# Altium project 电感.PrjPcb
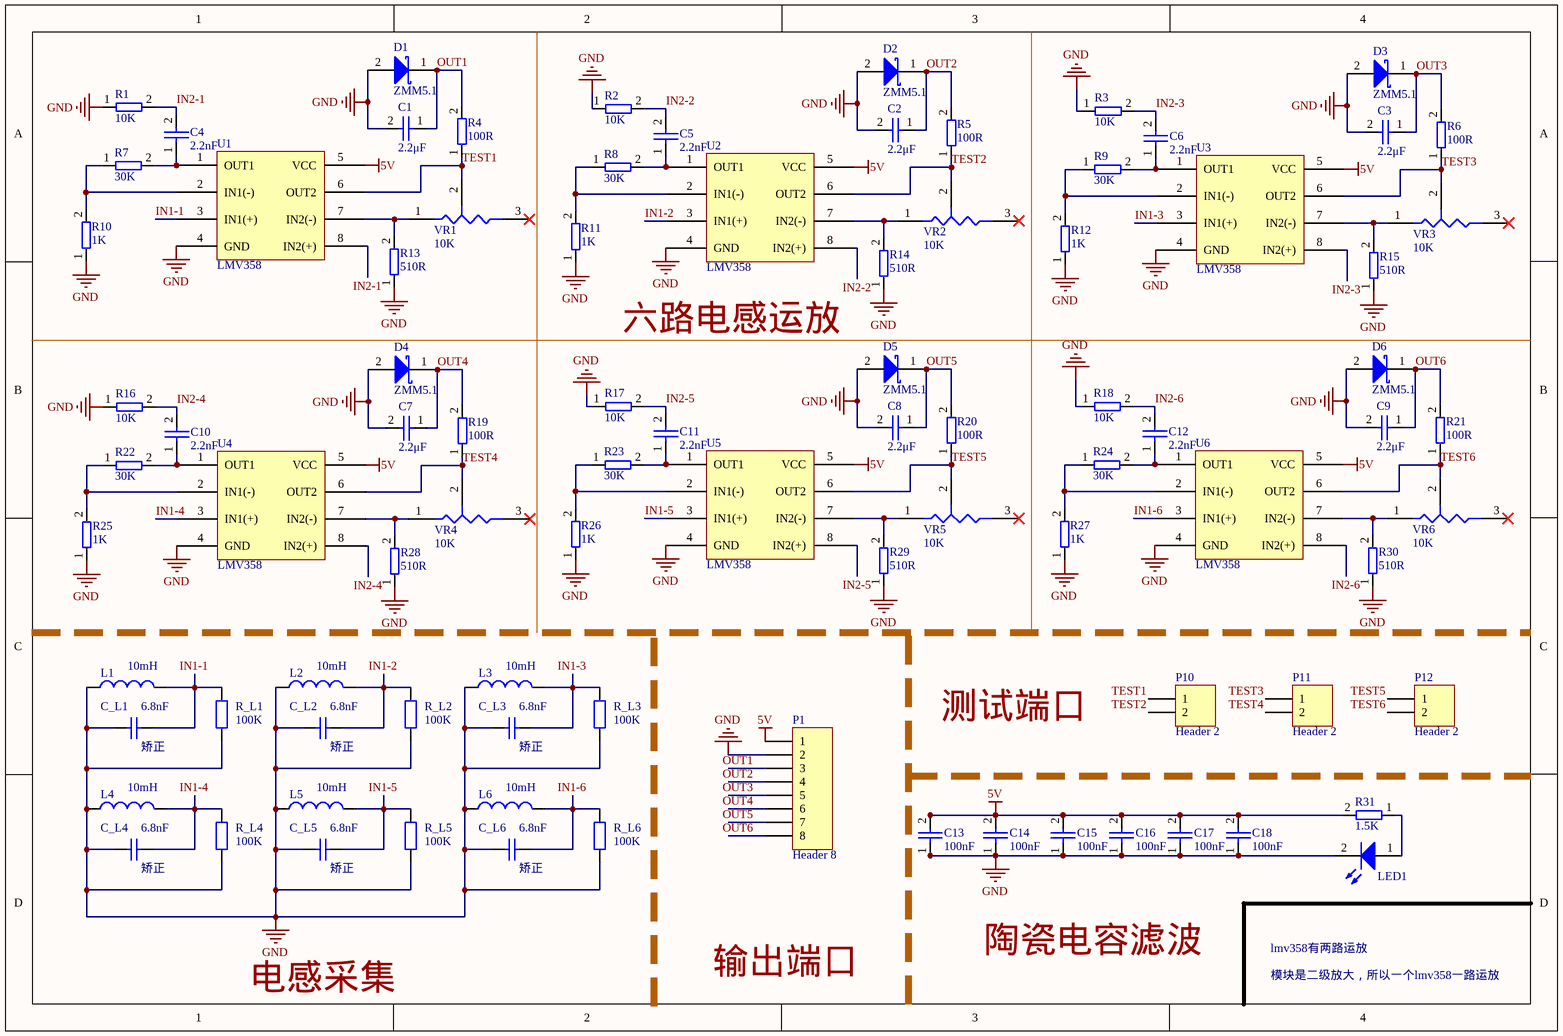
[diagram p0: 电感板原理图.SchDoc]
1 sheet, 90 parts. Net scope: global (net labels, ports and power ports of the same name join across sheets).
Board file: 电感板PCB.PcbDoc

## Sheet 电感板原理图.SchDoc
size A4

### Parts
C1  2.2μF  [C 0603_L]
C2  2.2μF  [C 0603_L]
C3  2.2μF  [C 0603_L]
C4  2.2nF  [0805C]
C5  2.2nF  [0805C]
C6  2.2nF  [0805C]
C7  2.2μF  [C 0603_L]
C8  2.2μF  [C 0603_L]
C9  2.2μF  [C 0603_L]
C10  2.2nF  [0805C]
C11  2.2nF  [0805C]
C12  2.2nF  [0805C]
C13  100nF  [0805C]
C14  100nF  [0805C]
C15  100nF  [0805C]
C16  100nF  [0805C]
C17  100nF  [0805C]
C18  100nF  [0805C]
C_L1  矫正  value 6.8nF  [RAD-0.3]
C_L2  矫正  value 6.8nF  [RAD-0.3]
C_L3  矫正  value 6.8nF  [RAD-0.3]
C_L4  矫正  value 6.8nF  [RAD-0.3]
C_L5  矫正  value 6.8nF  [RAD-0.3]
C_L6  矫正  value 6.8nF  [RAD-0.3]
D1  ZMM5.1  [1206C]
D2  ZMM5.1  [1206C]
D3  ZMM5.1  [1206C]
D4  ZMM5.1  [1206C]
D5  ZMM5.1  [1206C]
D6  ZMM5.1  [1206C]
L1  value 10mH  [HDR1X2]  (hidden comment: Inductor)
L2  value 10mH  [HDR1X2]  (hidden comment: Inductor)
L3  value 10mH  [HDR1X2]  (hidden comment: Inductor)
L4  value 10mH  [HDR1X2]  (hidden comment: Inductor)
L5  value 10mH  [HDR1X2]  (hidden comment: Inductor)
L6  value 10mH  [HDR1X2]  (hidden comment: Inductor)
LED1  LED  [LED0805R]  (value not drawn)
P1  Header 8  [HDR1X8]
P10  Header 2  [HDR1X2]
P11  Header 2  [HDR1X2]
P12  Header 2  [HDR1X2]
R1  10K  [0805-1R]
R2  10K  [0805-1R]
R3  10K  [0805-1R]
R4  100R  [0805-0R]
R5  100R  [0805-0R]
R6  100R  [0805-0R]
R7  30K  [0805-1R]
R8  30K  [0805-1R]
R9  30K  [0805-1R]
R10  1K  [0805-1R]
R11  1K  [0805-1R]
R12  1K  [0805-1R]
R13  510R  [0805-0R]
R14  510R  [0805-0R]
R15  510R  [0805-0R]
R16  10K  [0805-1R]
R17  10K  [0805-1R]
R18  10K  [0805-1R]
R19  100R  [0805-0R]
R20  100R  [0805-0R]
R21  100R  [0805-0R]
R22  30K  [0805-1R]
R23  30K  [0805-1R]
R24  30K  [0805-1R]
R25  1K  [0805-1R]
R26  1K  [0805-1R]
R27  1K  [0805-1R]
R28  510R  [0805-0R]
R29  510R  [0805-0R]
R30  510R  [0805-0R]
R31  1.5K  [0805-1R]
R_L1  value 100K  [0805-1R]  (hidden comment: Res2)
R_L2  value 100K  [0805-1R]  (hidden comment: Res2)
R_L3  value 100K  [0805-1R]  (hidden comment: Res2)
R_L4  value 100K  [0805-1R]  (hidden comment: Res2)
R_L5  value 100K  [0805-1R]  (hidden comment: Res2)
R_L6  value 100K  [0805-1R]  (hidden comment: Res2)
U1  LMV358  [SOP8]
U2  LMV358  [SOP8]
U3  LMV358  [SOP8]
U4  LMV358  [SOP8]
U5  LMV358  [SOP8]
U6  LMV358  [SOP8]
VR1  10K  [3296W]
VR2  10K  [3296W]
VR3  10K  [3296W]
VR4  10K  [3296W]
VR5  10K  [3296W]
VR6  10K  [3296W]

### Nets
5V: C13.2 C14.2 C15.2 C16.2 C17.2 C18.2 P1.1 R31.2 U1.5(VCC) U2.5(VCC) U3.5(VCC) U4.5(VCC) U5.5(VCC) U6.5(VCC)
GND: C1.2 C2.2 C3.2 C7.2 C8.2 C9.2 C13.1 C14.1 C15.1 C16.1 C17.1 C18.1 C_L1.1 C_L2.1 C_L3.1 C_L4.1 C_L5.1 C_L6.1 D1.2(A) D2.2(A) D3.2(A) D4.2(A) D5.2(A) D6.2(A) L1.1 L2.1 L3.1 L4.1 L5.1 L6.1 LED1.2(K) P1.2 R1.1 R2.1 R3.1 R10.1 R11.1 R12.1 R13.1 R14.1 R15.1 R16.1 R17.1 R18.1 R25.1 R26.1 R27.1 R28.1 R29.1 R30.1 R_L1.1 R_L2.1 R_L3.1 R_L4.1 R_L5.1 R_L6.1 U1.4(GND) U2.4(GND) U3.4(GND) U4.4(GND) U5.4(GND) U6.4(GND)
IN1-1: C_L1.2 L1.2 R_L1.2 U1.3(IN1(+))
IN1-2: C_L2.2 L2.2 R_L2.2 U2.3(IN1(+))
IN1-3: C_L3.2 L3.2 R_L3.2 U3.3(IN1(+))
IN1-4: C_L4.2 L4.2 R_L4.2 U4.3(IN1(+))
IN1-5: C_L5.2 L5.2 R_L5.2 U5.3(IN1(+))
IN1-6: C_L6.2 L6.2 R_L6.2 U6.3(IN1(+))
IN2-1: C4.2 R1.2 U1.8(IN2(+))
IN2-2: C5.2 R2.2 U2.8(IN2(+))
IN2-3: C6.2 R3.2 U3.8(IN2(+))
IN2-4: C10.2 R16.2 U4.8(IN2(+))
IN2-5: C11.2 R17.2 U5.8(IN2(+))
IN2-6: C12.2 R18.2 U6.8(IN2(+))
OUT1: C1.1 D1.1(K) P1.3 R4.2
OUT2: C2.1 D2.1(K) P1.4 R5.2
OUT3: C3.1 D3.1(K) P1.5 R6.2
OUT4: C7.1 D4.1(K) P1.6 R19.2
OUT5: C8.1 D5.1(K) P1.7 R20.2
OUT6: C9.1 D6.1(K) P1.8 R21.2
TEST1: P10.1 R4.1 U1.6(OUT2) VR1.2(TAP)
TEST2: P10.2 R5.1 U2.6(OUT2) VR2.2(TAP)
TEST3: P11.1 R6.1 U3.6(OUT2) VR3.2(TAP)
TEST4: P11.2 R19.1 U4.6(OUT2) VR4.2(TAP)
TEST5: P12.1 R20.1 U5.6(OUT2) VR5.2(TAP)
TEST6: P12.2 R21.1 U6.6(OUT2) VR6.2(TAP)
NetC4_1: C4.1 R7.2 U1.1(OUT1)
NetC5_1: C5.1 R8.2 U2.1(OUT1)
NetC6_1: C6.1 R9.2 U3.1(OUT1)
NetC10_1: C10.1 R22.2 U4.1(OUT1)
NetC11_1: C11.1 R23.2 U5.1(OUT1)
NetC12_1: C12.1 R24.2 U6.1(OUT1)
NetLED1_1: LED1.1(A) R31.1
NetR7_1: R7.1 R10.2 U1.2(IN1(-))
NetR8_1: R8.1 R11.2 U2.2(IN1(-))
NetR9_1: R9.1 R12.2 U3.2(IN1(-))
NetR13_2: R13.2 U1.7(IN2(-)) VR1.1(A)
NetR14_2: R14.2 U2.7(IN2(-)) VR2.1(A)
NetR15_2: R15.2 U3.7(IN2(-)) VR3.1(A)
NetR22_1: R22.1 R25.2 U4.2(IN1(-))
NetR23_1: R23.1 R26.2 U5.2(IN1(-))
NetR24_1: R24.1 R27.2 U6.2(IN1(-))
NetR28_2: R28.2 U4.7(IN2(-)) VR4.1(A)
NetR29_2: R29.2 U5.7(IN2(-)) VR5.1(A)
NetR30_2: R30.2 U6.7(IN2(-)) VR6.1(A)

Not connected (* = marked no-connect by the designer): VR1 3(B)*; VR2 3(B)*; VR3 3(B)*; VR4 3(B)*; VR5 3(B)*; VR6 3(B)*

### Notes on the sheet
- 六路电感运放
- 测试端口
- 输出端口
- 陶瓷电容滤波
- 模块是二级放大，所以一个lmv358一路运放
- lmv358有两路运放
- 电感采集

### Library data of the parts
C1-C12 = Cap
C13-C18 = Cap: 陶瓷电容
C_L1-C_L6 = Cap: Capacitor; Published: 8-Jun-2000; LatestRevisionDate: 17-Jul-2002; LatestRevisionNote: Re-released for DXP Platform.; PackageReference: RAD-0.3; Publisher: Altium Limited; PackageDescription: Radial Cap, Thru-Hole; 2 Leads; 0.3 in Pin Spacing
D1-D6 = Diode 10TQ040: Schottky Rectifier; pin to pad: 3>2; Note: Terminal 2 is the TAB and is electrically connected to the cathode; Published: 8-Jun-2000; LatestRevisionDate: 17-Jul-2002; LatestRevisionNote: Re-released for DXP Platform.; DatasheetVersion: PD-2.057B; PackageVersion: Feb-1998; PackageReference: TO-220AC; Publisher: Altium Limited; PackageDescription: TO, Thru-Hole, Vertical, Heatsink Mounted; 3 In-Line Leads (1 Absent); Pitch 2.54 mm; ComponentLink1Description: Manufacturer Link; ComponentLink1URL: http://www.irf.com/
L1-L6 = Inductor: Code_IEC: 1005; Published: 8-Jun-2000; LatestRevisionDate: 29-May-2009; LatestRevisionNote: IPC-7351 Footprint Added.; PackageReference: 0402-A; Publisher: Altium Limited; PackageDescription: Chip Inductor; Code_JEITA: 0402
LED1 = LED3: Typical BLUE SiC LED; Published: 8-Jun-2000; LatestRevisionDate: 17-Dec-2003; LatestRevisionNote: PCB Footprint replaced.; DatasheetDocument: 16-Apr-2002; PackageDocument: 16-Apr-2002; PackageReference: 3.5X2.8X1.9; Publisher: Altium Limited
P1 = Header 8: Header, 8-Pin; LatestRevisionDate: 17-Jul-2002; LatestRevisionNote: Re-released for DXP Platform.; Publisher: Altium Limited
P10-P12 = Header 2: Header, 2-Pin; LatestRevisionDate: 17-Jul-2002; LatestRevisionNote: Re-released for DXP Platform.; Publisher: Altium Limited
R1-R31 = 0805R
R_L1-R_L6 = Res2: Resistor; Published: 8-Jun-2000; LatestRevisionDate: 17-Jul-2002; LatestRevisionNote: Re-released for DXP Platform.; PackageReference: AXIAL-0.4; Publisher: Altium Limited; PackageDescription: Axial Device, Thru-Hole; 2 Leads; 0.4 in Pin Spacing
U1-U6 = LMV358: pin to pad: 5>8 6>7 7>6 8>5
VR1-VR6 = Res Tap: Tapped Resistor; Sim Note: Enter the Resistance value and the set point into parameter fields.; Set Position: 0.5; Value: 1K; Published: 24-Mar-1999; LatestRevisionDate: 17-Jul-2002; LatestRevisionNote: Re-released for DXP Platform.; PackageReference: VR3; Publisher: Altium Limited; PackageDescription: Variable Resistor, Thru-Hole; 3 Leads